# EAGLE design schaltplan (EAGLE 7.7.0)
CNAME: Studienarbeit 2016/2017; CREVISION: 3.5; DESIGNER: Jan G. & David P.
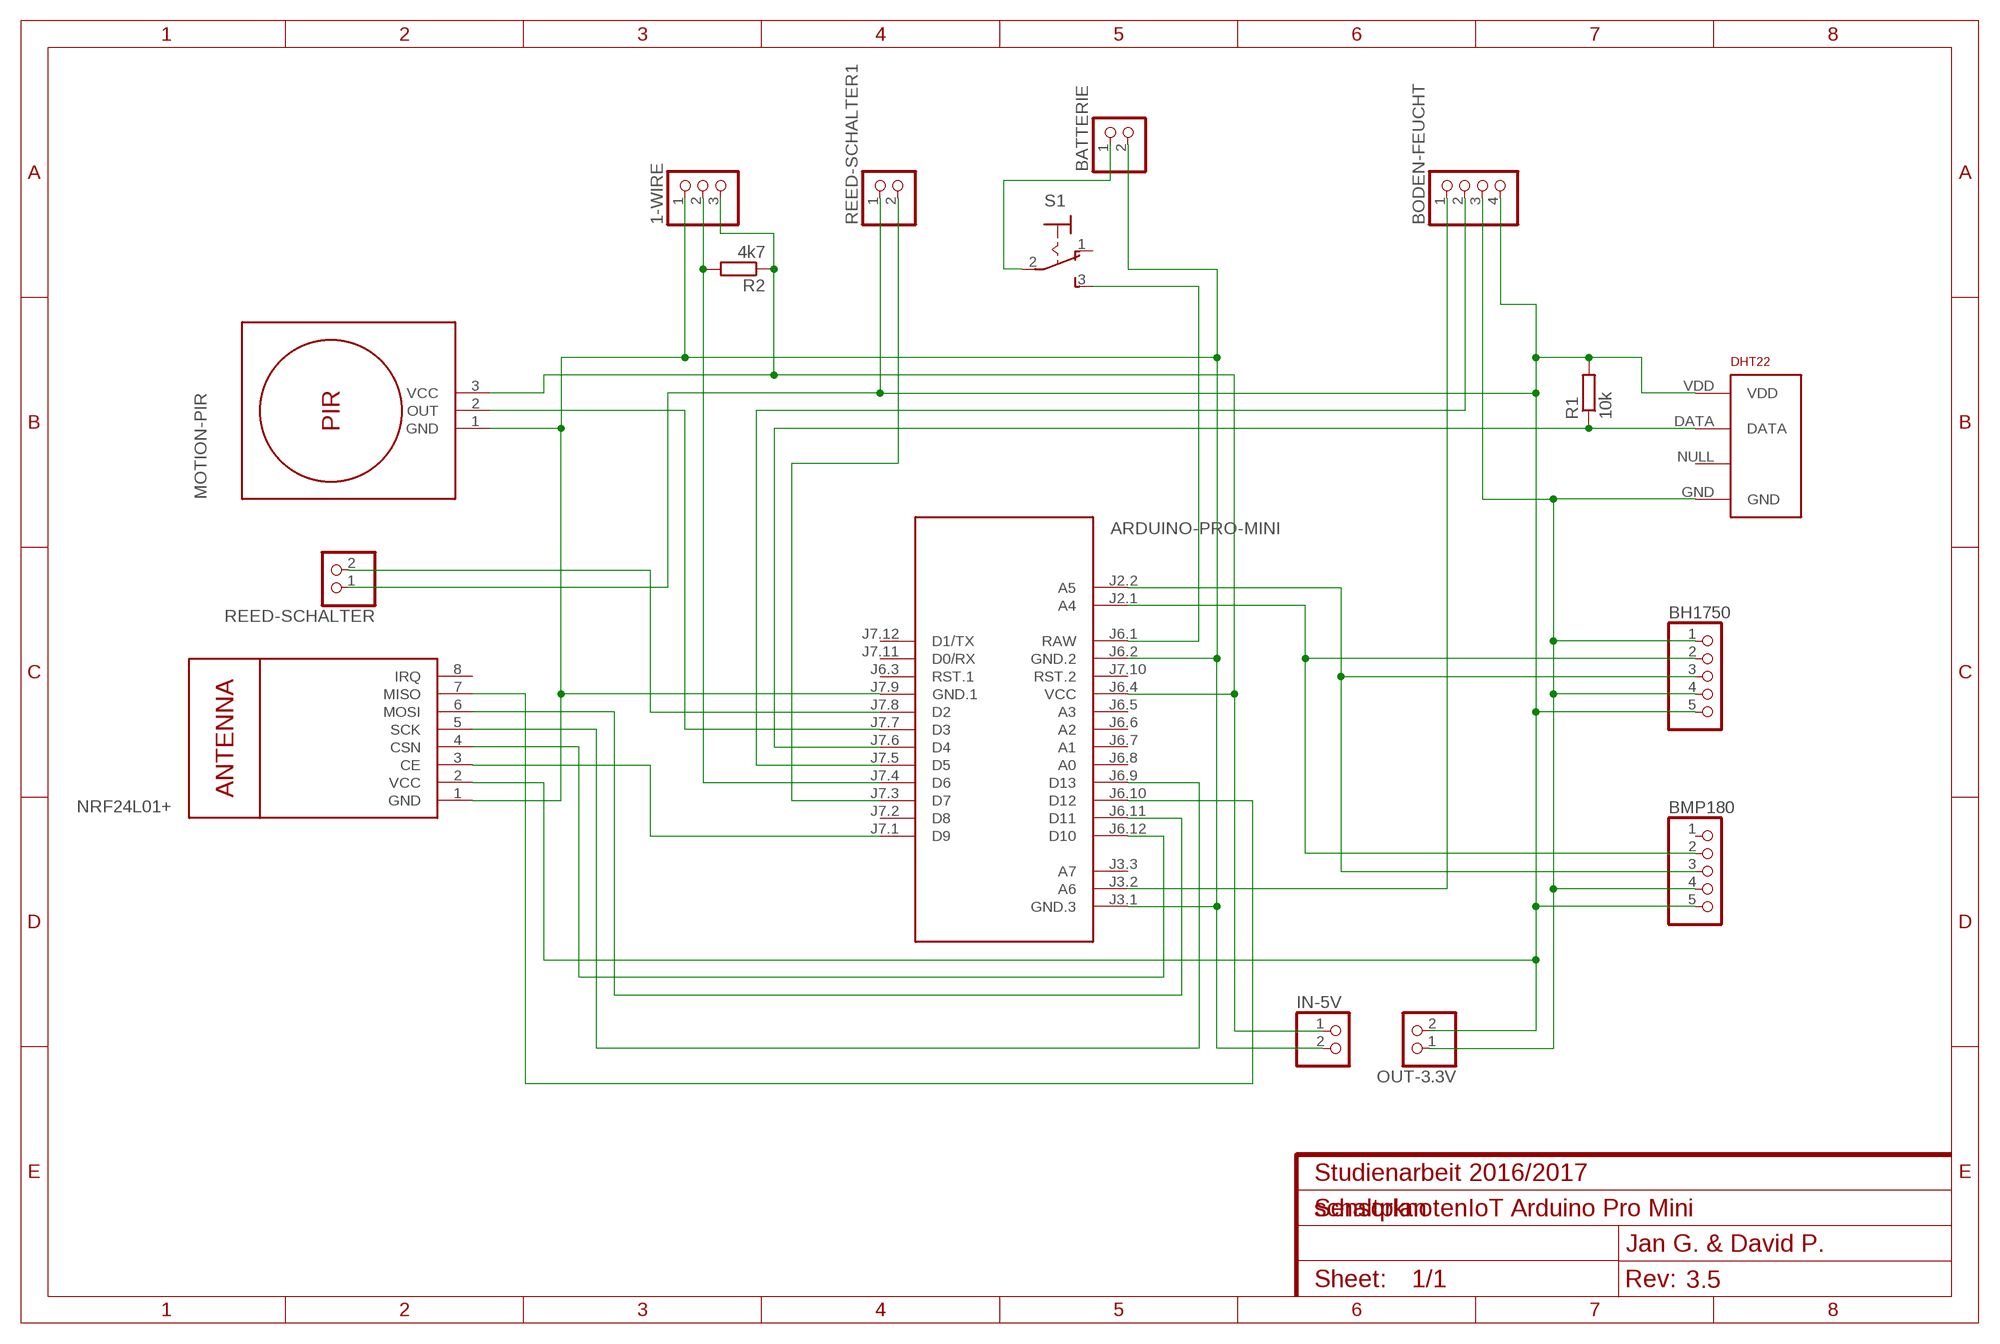
[diagram p0: schematic, sheet 1]

## Parts
1-WIRE  PINHD-1X3  [1X03]
ARDUINO-PRO-MINI  ARDUINO-PRO-MINI-5.0V#NP  [ARDUINO-PRO-MINI#NP]
BATTERIE  PINHD-1X2  [1X02]
BH1750  PINHD-1X5  [1X05]
BMP180  PINHD-1X5  [1X05]
BODEN-FEUCHT  PINHD-1X4  [1X04]
DHT22  RHT03_DHT-22_AM2302  [RHT03_DHT-22]
IN-5V  PINHD-1X2  [1X02]
MOTION-PIR  MOTION-PIR-DYP-ME003  [MOTION-PIR-DYP-ME003]
NRF24L01+  WIRELESS-NRF24L01  [WIRELESS-NRF24L01]
OUT-3.3V  PINHD-1X2  [1X02]
R1  10k  R-EU_0207/10  [0207/10]
R2  4k7  R-EU_0207/10  [0207/10]
REED-SCHALTER  PINHD-1X2  [1X02]
REED-SCHALTER1  PINHD-1X2  [1X02]
S1  320-916  [320-916]

## Nets
3.3V: BH1750.5 BMP180.5 BODEN-FEUCHT.4 DHT22.VDD NRF24L01+.2(VCC) OUT-3.3V.2 R1.2 REED-SCHALTER1.1 REED-SCHALTER.1
GND: 1-WIRE.1 ARDUINO-PRO-MINI.J3.1(GND.3) ARDUINO-PRO-MINI.J6.2(GND.2) ARDUINO-PRO-MINI.J7.9(GND.1) BATTERIE.2 BH1750.1 BH1750.4 BMP180.4 BODEN-FEUCHT.3 DHT22.GND IN-5V.2 MOTION-PIR.1(GND) NRF24L01+.1(GND) OUT-3.3V.1
IN-3.3V: 1-WIRE.3 ARDUINO-PRO-MINI.J6.4(VCC) IN-5V.1 MOTION-PIR.3(VCC) R2.1
N$1: ARDUINO-PRO-MINI.J6.1(RAW) S1.3(S)
N$2: BATTERIE.1 S1.2(P)
N$5: ARDUINO-PRO-MINI.J7.5(D5) BODEN-FEUCHT.2
N$6: ARDUINO-PRO-MINI.J7.6(D4) DHT22.DATA R1.1
N$7: 1-WIRE.2 ARDUINO-PRO-MINI.J7.4(D6) R2.2
N$8: ARDUINO-PRO-MINI.J3.2(A6) BODEN-FEUCHT.1
N$9: ARDUINO-PRO-MINI.J7.3(D7) REED-SCHALTER1.2
N$10: ARDUINO-PRO-MINI.J7.7(D3) MOTION-PIR.2(OUT)
N$11: ARDUINO-PRO-MINI.J7.8(D2) REED-SCHALTER.2
N$12: ARDUINO-PRO-MINI.J2.1(A4) BH1750.2 BMP180.2
N$13: ARDUINO-PRO-MINI.J2.2(A5) BH1750.3 BMP180.3
N$15: ARDUINO-PRO-MINI.J7.1(D9) NRF24L01+.3(CE)
N$16: ARDUINO-PRO-MINI.J6.12(D10) NRF24L01+.4(CSN)
N$17: ARDUINO-PRO-MINI.J6.9(D13) NRF24L01+.5(SCK)
N$18: ARDUINO-PRO-MINI.J6.11(D11) NRF24L01+.6(MOSI)
N$19: ARDUINO-PRO-MINI.J6.10(D12) NRF24L01+.7(MISO)
Unconnected: ARDUINO-PRO-MINI.J3.3(A7) ARDUINO-PRO-MINI.J6.3(RST.1) ARDUINO-PRO-MINI.J6.5(A3) ARDUINO-PRO-MINI.J6.6(A2) ARDUINO-PRO-MINI.J6.7(A1) ARDUINO-PRO-MINI.J6.8(A0) ARDUINO-PRO-MINI.J7.2(D8) ARDUINO-PRO-MINI.J7.10(RST.2) ARDUINO-PRO-MINI.J7.11(D0/RX) ARDUINO-PRO-MINI.J7.12(D1/TX) BMP180.1 DHT22.NULL NRF24L01+.8(IRQ) S1.1(O)

## Notes on the sheet
- SensorknotenIoT Arduino Pro Mini

## Library data of the parts
1-WIRE = pinhead:PINHD-1X3: PIN HEADER
ARDUINO-PRO-MINI = diy-modules:ARDUINO-PRO-MINI-*#NP: Arduino Pro Mini without programming pads
BATTERIE IN-5V OUT-3.3V REED-SCHALTER REED-SCHALTER1 = pinhead:PINHD-1X2: PIN HEADER
BH1750 BMP180 = pinhead:PINHD-1X5: PIN HEADER
BODEN-FEUCHT = pinhead:PINHD-1X4: PIN HEADER
DHT22 = RHT03_DHT-22_AM2302:RHT03_DHT-22_AM2302: RHT03 / DHT-22 / AM2302 Packages and symbol for the RHT03 / DHT-22 relative humidity and temperature sensor. Note: The AM2302 is a wired version of the DHT-22 which typically requires less clearance and is thus provided as a separate package.; PROD_ID: SEN-10167
MOTION-PIR = diy-modules:MOTION-PIR-DYP-ME003: PIR Motion Sensor Module DYP-ME003 based on BISS0001 pyroelectic detector
NRF24L01+ = diy-modules:WIRELESS-NRF24L01: 2.4 GHz Wireless Module based on NRF24L01 chip
R1 R2 = resistor:R-EU_: RESISTOR, European symbol
S1 = switch:320-916: TOGGLE SWITCH distributor RS Components

## Board
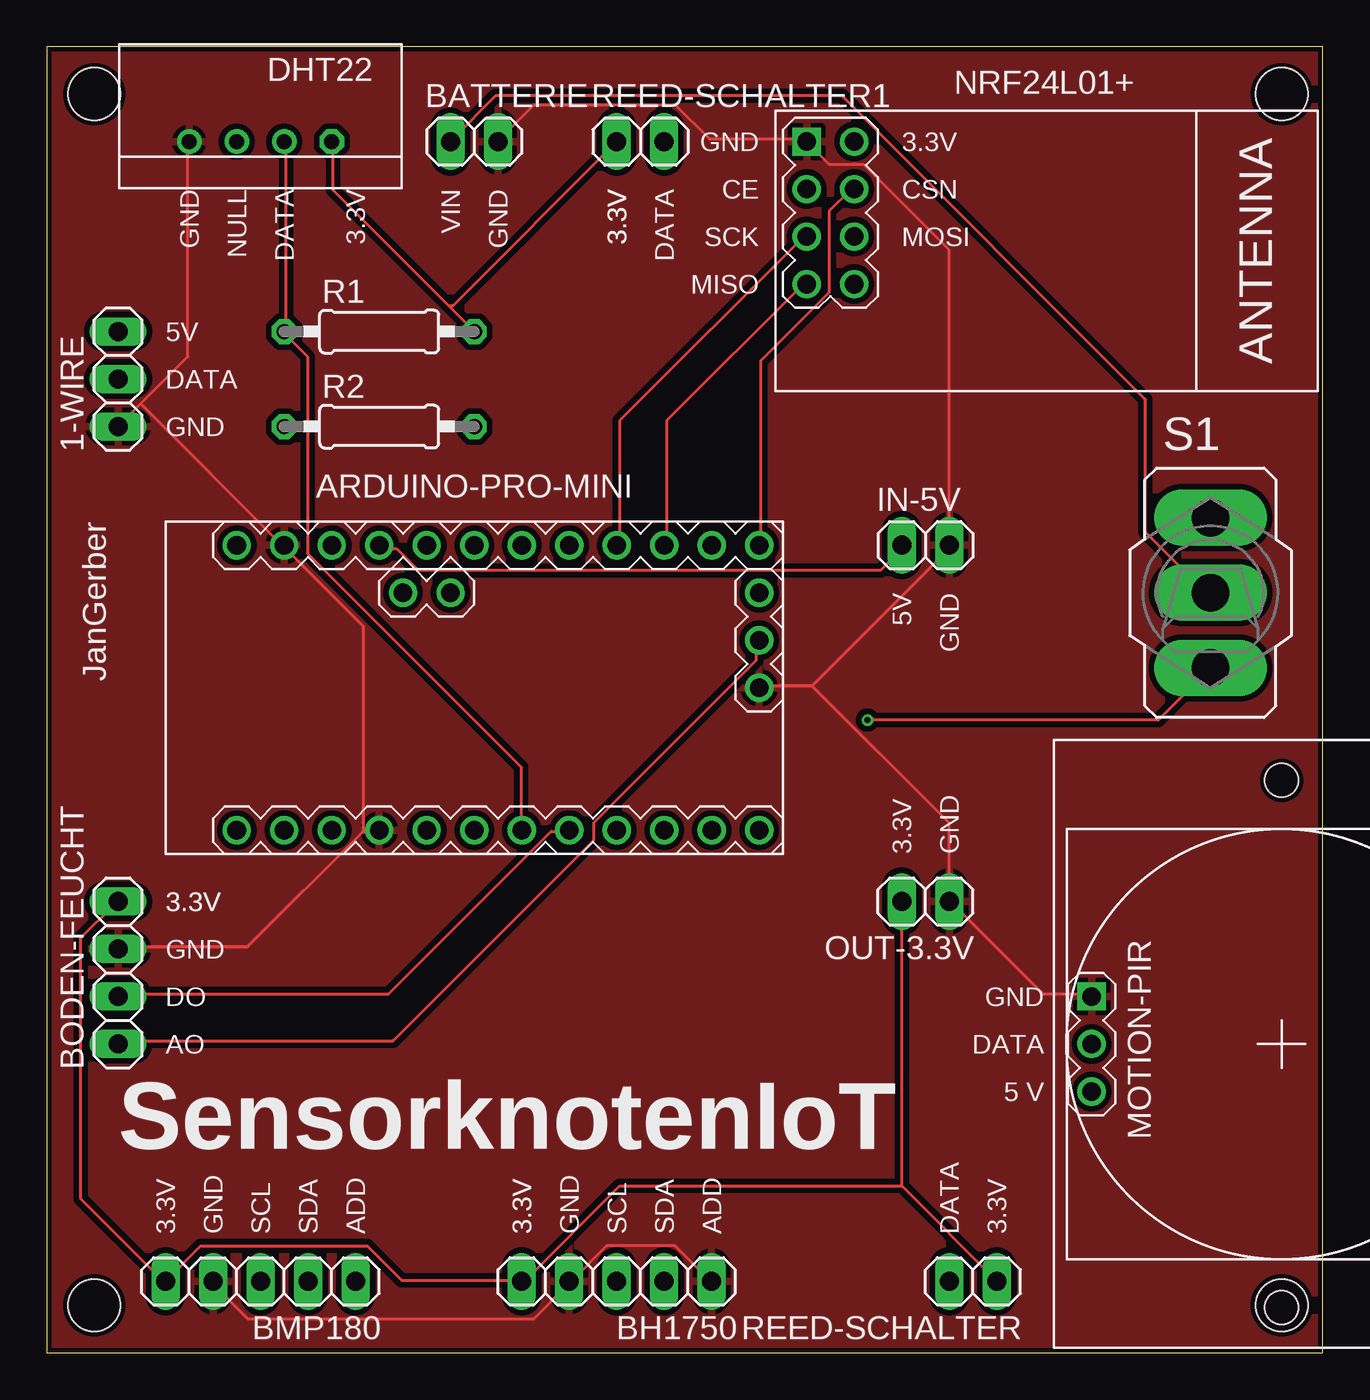
[diagram p1: board, top side]
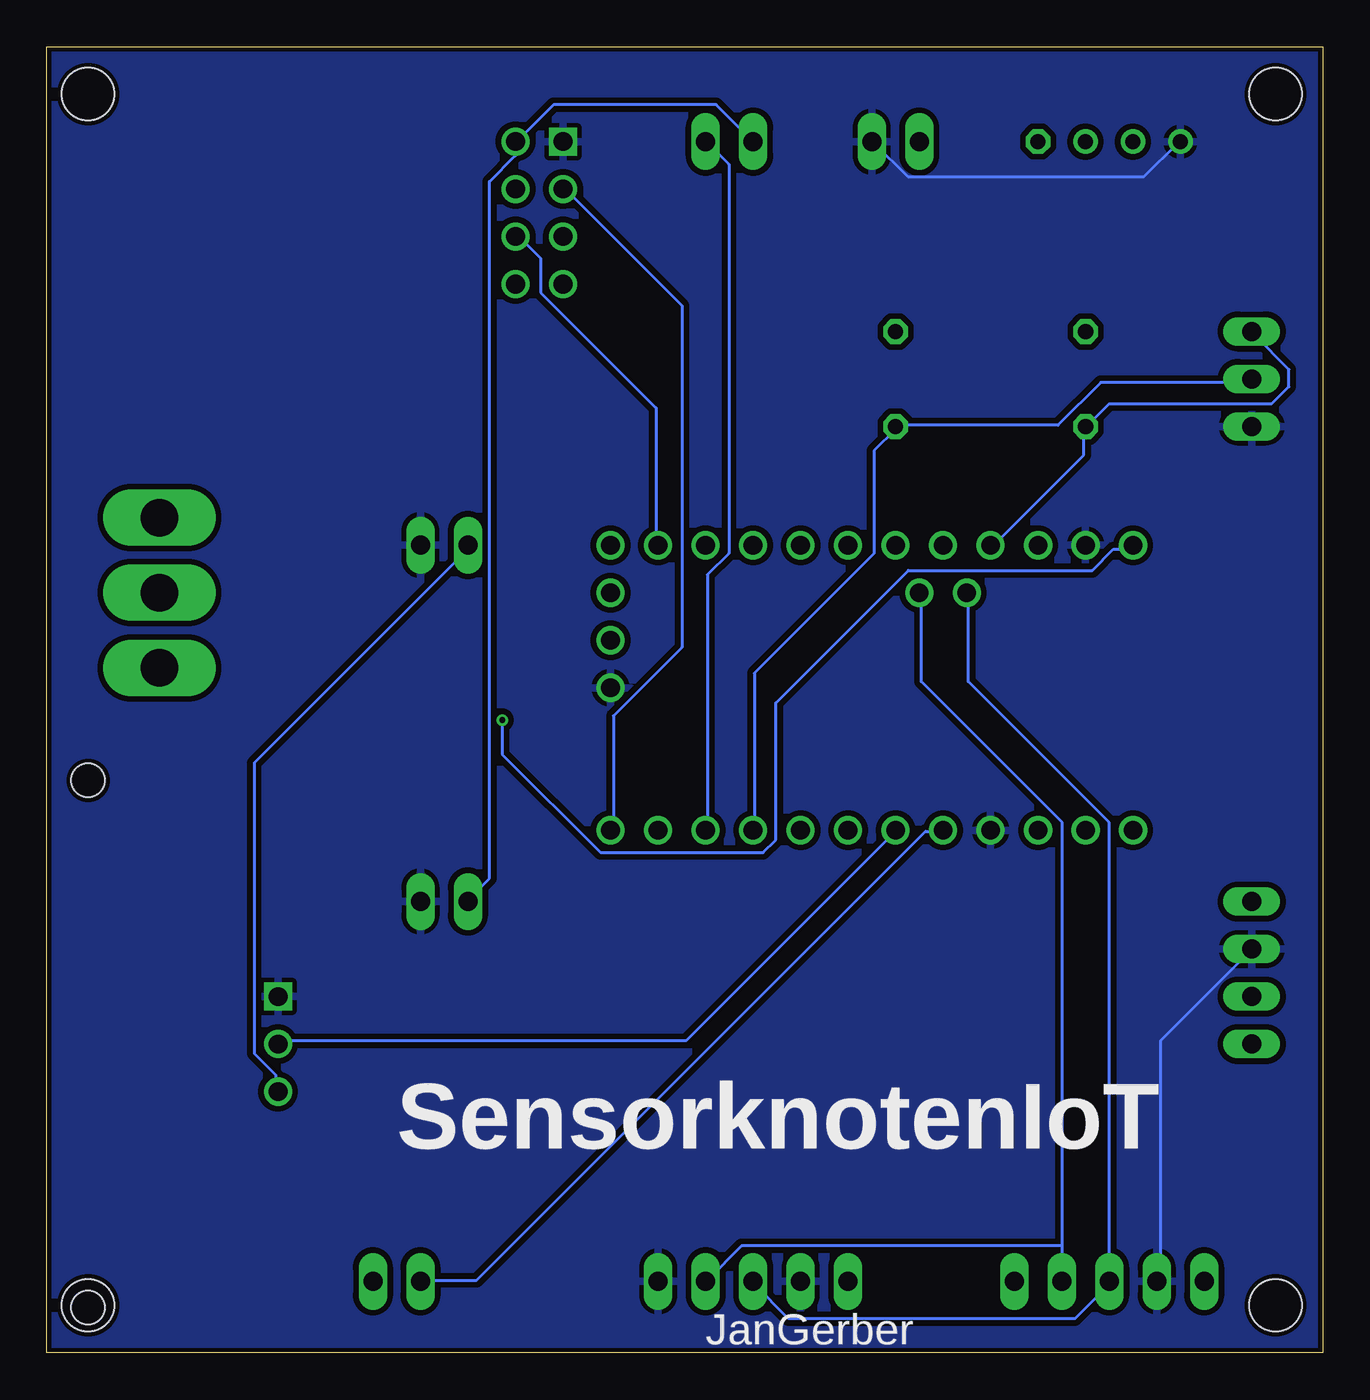
[diagram p2: board, bottom side, seen from below]

Size 68.25 x 69.84 mm. Coordinates in mm from the lower left corner, seen from the top.
Outline: 0,0 68.25,0 68.25,69.84 0,69.84 0,0
Copper layers (1*16): Top 0.035mm / dielectric 1.5mm / Bottom 0.035mm
Design rules "SeeedStudio_2layer_DRU_no_angle_20140221 *": minimum track width 6mil, minimum drill 12mil, track to track 12mil, track to pad 12mil, pad to pad 6mil, via to via 6mil, smd to smd 0mil, copper to edge 10mil, drill to drill 10mil, minimum pad ring 10mil, minimum via ring 6mil, stop-mask expansion 2mil, vias tented up to drill 100mil, thermal gap 10mil
Holes 2.8 mm at 2.54,2.54 66.04,2.54 66.04,67.31 2.54,67.31

### Footprints (pad centres in the part's own frame; a part is rotated, then mirrored left to right if it is on the bottom)
1X03 = drill 1.016 long: 1 -2.54,0; 2 0,0; 3 2.54,0
ARDUINO-PRO-MINI#NP = drill 1: J2.1 -1.27,5.08; J2.2 -3.81,5.08; J3.1 15.24,0; J3.2 15.24,2.54; J3.3 15.24,5.08; J6.1 -12.7,7.62; J6.2 -10.16,7.62; J6.3 -7.62,7.62; J6.4 -5.08,7.62; J6.5 -2.54,7.62; J6.6 0,7.62; J6.7 2.54,7.62; J6.8 5.08,7.62; J6.9 7.62,7.62; J6.10 10.16,7.62; J6.11 12.7,7.62; J6.12 15.24,7.62; J7.1 15.24,-7.62; J7.2 12.7,-7.62; J7.3 10.16,-7.62; J7.4 7.62,-7.62; J7.5 5.08,-7.62; J7.6 2.54,-7.62; J7.7 0,-7.62; J7.8 -2.54,-7.62; J7.9 -5.08,-7.62; J7.10 -7.62,-7.62; J7.11 -10.16,-7.62; J7.12 -12.7,-7.62
1X02 = drill 1.016 long: 1 -1.27,0; 2 1.27,0
1X05 = drill 1.016 long: 1 -5.08,0; 2 -2.54,0; 3 0,0; 4 2.54,0; 5 5.08,0
1X04 = drill 1.016 long: 1 -3.81,0; 2 -1.27,0; 3 1.27,0; 4 3.81,0
RHT03_DHT-22 = drill 0.8: DATA -1.27,0; GND 3.81,0; NULL 1.27,0 | drill 0.8 octagon: VDD -3.81,0
MOTION-PIR-DYP-ME003 = drill 1 square: 1 -2.54,-10.16 | drill 1: 2 0,-10.16; 3 2.54,-10.16 | hole 1.8: -14.1,0; 14.1,0
WIRELESS-NRF24L01 = drill 1 square: 1 -12.7,6.35 | drill 1: 2 -10.16,6.35; 3 -12.7,3.81; 4 -10.16,3.81; 5 -12.7,1.27; 6 -10.16,1.27; 7 -12.7,-1.27; 8 -10.16,-1.27
0207/10 = drill 0.813 octagon: 1 -5.08,0; 2 5.08,0
320-916 = drill 2.007 long: 1 0,4.013; 2 0,0; 3 0,-4.013

### Placement (x,y rotation side)
1-WIRE  3.81,52.07 90 top
ARDUINO-PRO-MINI  22.86,35.56 0 top
BATTERIE  22.86,64.77 0 top
BH1750  30.48,3.81 180 top
BMP180  11.43,3.81 180 top
BODEN-FEUCHT  3.81,20.32 90 top
DHT22  11.43,64.77 180 top
IN-5V  46.99,43.18 0 top
MOTION-PIR  66.04,16.51 270 top
NRF24L01+  53.34,58.42 0 top
OUT-3.3V  46.99,24.13 180 top
R1  17.78,54.61 0 top
R2  17.78,49.53 0 top
REED-SCHALTER  49.53,3.81 180 top
REED-SCHALTER1  31.75,64.77 0 top
S1  62.23,40.64 0 top

### Tracks (layer width: path | path; a pad name or v marks a point on that pad's centre or on a via)
3.3V
  Top 0.152: 21.49,56.01 22.86,54.63 R1.2 | 21.49,56.01 15.32,62.18 15.32,64.69 DHT22.VDD | REED-SCHALTER1.1 21.72,56.01 21.49,56.01 | 45.72,8.91 OUT-3.3V.2 | 45.72,8.91 50.75,3.89 REED-SCHALTER.1 | BODEN-FEUCHT.4 3.66,24 1.83,22.17 1.83,8.23 6.17,3.89 BMP180.5 6.4,3.89 8.23,5.71 17.14,5.71 18.97,3.89 25.38,3.89 BH1750.5 25.6,3.89 30.63,8.91 45.72,8.91
  Bottom 0.152: REED-SCHALTER1.1 32.46,66.75 41.15,66.75 42.98,64.92 NRF24L01+.2 43.2,64.69 43.2,64.01 44.58,62.64 44.58,25.38 45.72,24.23 OUT-3.3V.2
GND
  Top 0.152: BH1750.1 35.43,3.89 33.6,5.71 29.95,5.71 28.12,3.89 BH1750.4 27.89,3.66 26.06,1.83 10.74,1.83 8.91,3.66 BMP180.4 | 16.92,27.89 17.6,27.89 ARDUINO-PRO-MINI.J7.9 | 16.92,27.89 10.74,21.72 3.89,21.72 BODEN-FEUCHT.3 | MOTION-PIR.1 55.78,19.2 53.26,19.2 48.46,24 OUT-3.3V.1 48.23,24.23 48.23,28.35 40.92,35.66 | 40.92,35.66 38.18,35.66 ARDUINO-PRO-MINI.J3.1 | 40.92,35.66 48.23,42.98 IN-5V.2 48.23,43.2 48.23,58.98 43.66,63.55 41.83,63.55 40.69,64.69 NRF24L01+.1 40.46,64.92 35.43,64.92 33.6,66.75 26.06,66.75 24.23,64.92 BATTERIE.2 | 1-WIRE.1 5.03,50.75 | 5.03,50.75 7.54,53.26 7.54,64.69 DHT22.GND | 5.03,50.75 12.57,43.2 ARDUINO-PRO-MINI.J6.2 12.8,42.98 16.92,38.86 16.92,27.89
  Bottom 0.152: BMP180.4 8.69,3.89 8.69,16.69 3.89,21.49 BODEN-FEUCHT.3 | BATTERIE.2 24,64.69 22.17,62.87 9.6,62.87 7.77,64.69 DHT22.GND
  pour Bottom: 0,69.85 68.58,69.85 68.58,0 0,0
  pour Top: 0,69.85 68.58,69.85 68.58,0 0,0
IN-3.3V
  Top 0.152: ARDUINO-PRO-MINI.J6.4 17.83,42.98 18.75,42.98 19.89,41.83 44.58,41.83 45.72,42.98 IN-5V.1
  Bottom 0.152: ARDUINO-PRO-MINI.J6.4 17.6,43.2 12.8,48.01 12.8,49.38 R2.1 12.57,49.61 11.43,50.75 2.74,50.75 1.83,51.66 1.83,52.58 3.66,54.41 1-WIRE.3 | MOTION-PIR.3 56.01,14.17 56.01,14.86 57.15,16 57.15,31.55 45.72,42.98 IN-5V.1
N$1  (via drill 0.3)
  Top 0.152: v43.89,33.83 59.44,33.83 S1.3
  Bottom 0.152: v43.89,33.83 43.89,32 38.63,26.75 29.95,26.75 29.26,27.43 29.26,34.75 22.17,41.83 12.34,41.83 11.2,42.98 10.29,42.98 ARDUINO-PRO-MINI.J6.1
N$2
  Top 0.152: BATTERIE.1 21.72,64.92 24,67.21 42.52,67.21 58.75,50.98 58.75,43.89 62.18,40.46 S1.2
N$5
  Top 0.152: ARDUINO-PRO-MINI.J7.5 27.89,27.89 26.98,27.89 18.29,19.2 3.89,19.2 BODEN-FEUCHT.2
N$6
  Top 0.152: DHT22.DATA 12.8,64.69 12.8,54.63 R1.1 12.8,54.41 13.95,53.26 13.95,42.75 25.38,31.32 25.38,28.12 ARDUINO-PRO-MINI.J7.6
N$7
  Bottom 0.152: 1-WIRE.2 3.89,51.89 11.89,51.89 14.17,49.61 22.86,49.61 R2.2 22.86,49.38 24,48.23 24,42.75 30.4,36.35 30.4,28.12 ARDUINO-PRO-MINI.J7.4
N$8
  Top 0.152: ARDUINO-PRO-MINI.J3.2 37.95,37.95 37.95,37.03 29.26,28.35 29.26,27.43 18.52,16.69 3.89,16.69 BODEN-FEUCHT.1
N$9
  Bottom 0.152: ARDUINO-PRO-MINI.J7.3 32.92,28.12 32.92,41.6 31.77,42.75 31.77,63.55 32.92,64.69 REED-SCHALTER1.2
N$10
  Bottom 0.152: MOTION-PIR.2 55.78,16.69 34.06,16.69 22.86,27.89 ARDUINO-PRO-MINI.J7.7
N$11
  Bottom 0.152: ARDUINO-PRO-MINI.J7.8 20.34,27.89 21.26,27.89 45.26,3.89 48.23,3.89 REED-SCHALTER.2
N$12
  Bottom 0.152: 13.95,5.71 13.95,3.89 BMP180.2 | 13.95,5.71 13.95,28.35 21.49,35.89 21.49,40.46 ARDUINO-PRO-MINI.J2.1 | 13.95,5.71 31.09,5.71 32.92,3.89 BH1750.2
N$13
  Bottom 0.152: ARDUINO-PRO-MINI.J2.2 18.97,40.46 18.97,35.89 11.43,28.35 BMP180.3 11.43,3.66 13.26,1.83 28.57,1.83 30.4,3.66 BH1750.3
N$15
  Bottom 0.152: ARDUINO-PRO-MINI.J7.1 37.95,28.12 37.95,34.06 34.29,37.72 34.29,56.01 40.46,62.18 NRF24L01+.3
N$16
  Top 0.152: ARDUINO-PRO-MINI.J6.12 38.18,43.2 38.18,53.03 41.83,56.69 41.83,61.04 42.98,62.18 NRF24L01+.4
N$17
  Top 0.152: ARDUINO-PRO-MINI.J6.9 30.63,43.2 30.63,49.84 40.46,59.66 NRF24L01+.5
N$18
  Bottom 0.152: ARDUINO-PRO-MINI.J6.11 35.66,43.2 35.66,50.52 41.83,56.69 41.83,58.52 42.98,59.66 NRF24L01+.6
N$19
  Top 0.152: ARDUINO-PRO-MINI.J6.10 33.15,43.2 33.15,49.84 40.46,57.15 NRF24L01+.7

### Text on the board
tPlace: GND | 3.3V | GND | NULL | DATA | 3.3V | VIN | GND | 3.3V | 3.3V | 3.3V | DATA | CE | CSN | SCK | MOSI | MISO | 5V | DATA | GND | JanGerber | 5V | GND | 3.3V | GND | 3.3V | 3.3V | GND | DO | GND | AO | DATA | 5 V | SensorknotenIoT | MOTION-PIR | 3.3V | GND | SCL | SDA | ADD | 3.3V | 3.3V | GND | SCL | SDA | ADD | DATA | 3.3V
bPlace: SensorknotenIoT | JanGerber